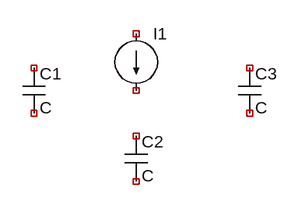
[diagram p0: schematic Draft2.asc]
Draft2.asc, the LTspice schematic file:
Version 4
SHEET 1 880 680
SYMBOL current 176 64 R0
WINDOW 123 0 0 Left 0
WINDOW 39 0 0 Left 0
SYMATTR InstName I1
SYMATTR Value ""
SYMBOL cap 16 112 R0
SYMATTR InstName C1
SYMBOL cap 160 208 R0
SYMATTR InstName C2
SYMBOL cap 320 112 R0
SYMATTR InstName C3

The netlist it stands for:
* Draft2.asc
I1 NC_01 NC_02
C1 NC_03 NC_04 C
C2 NC_05 NC_06 C
C3 NC_07 NC_08 C
.backanno
.end